# EAGLE design Tractive System Active Light rev5 (EAGLE 9.6.2)

## Sheet 1 of 2
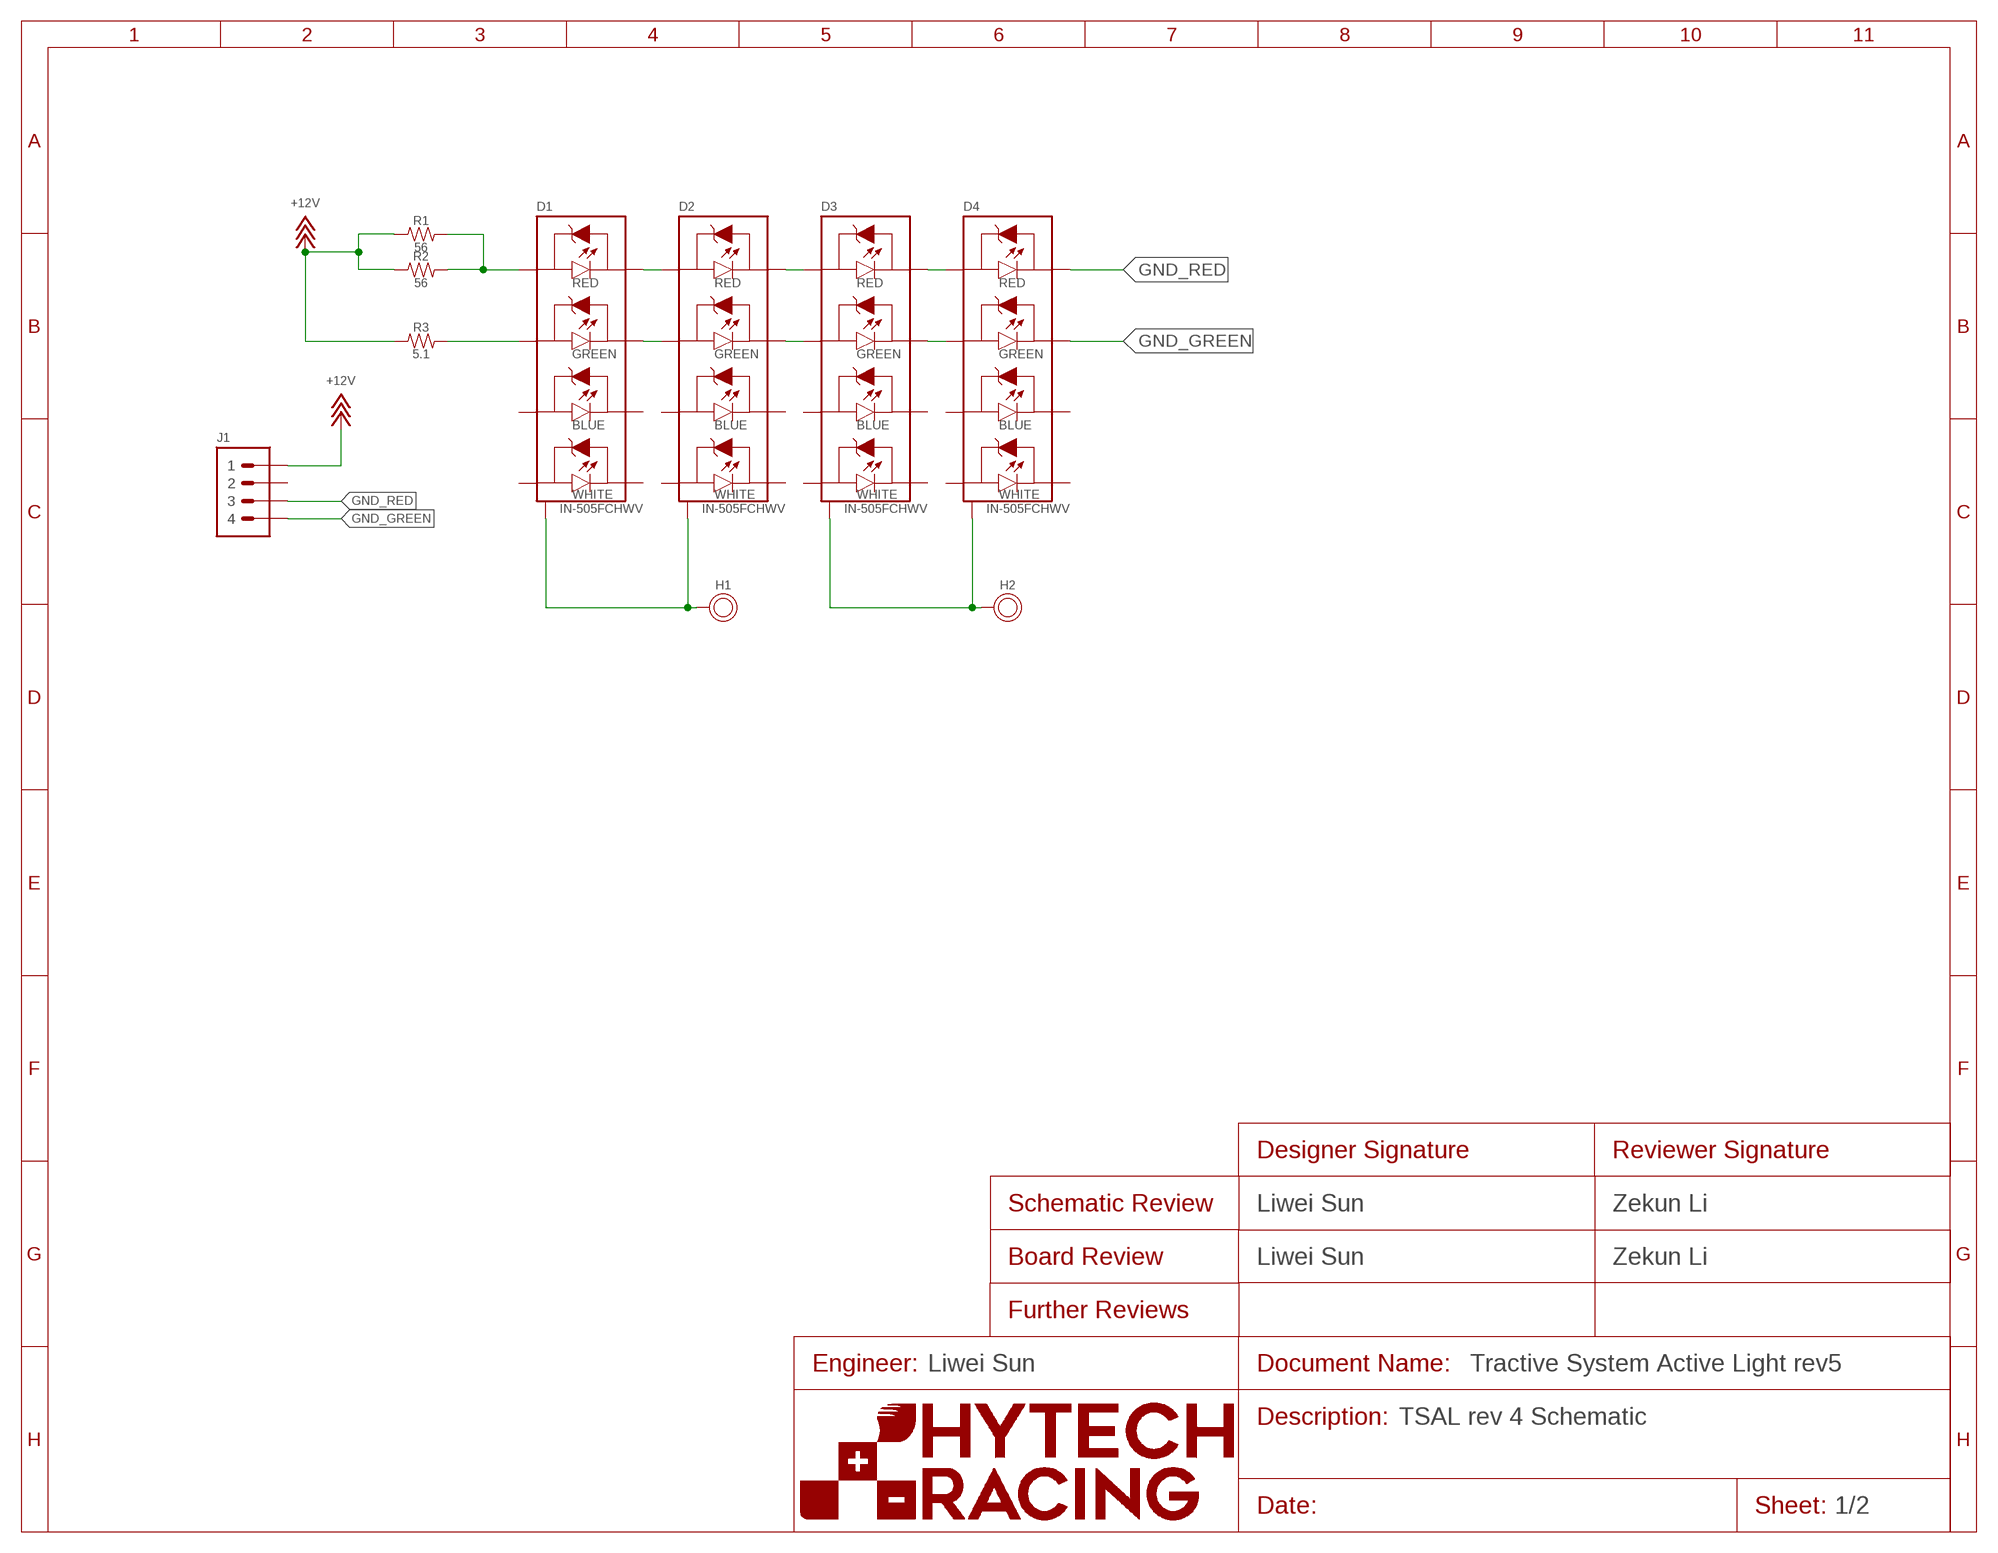
[diagram p0: schematic, sheet 1]
FRAME1 (FRAME): DESCRIPTION_1: TSAL rev 4 Schematic; DESIGNER_BOARD: Liwei Sun; DESIGNER_SCHEMATIC: Liwei Sun; ENGINEER: Liwei Sun; REVIEWER_BOARD: Zekun Li; REVIEWER_SCHEMATIC: Zekun Li

### Parts
D1  LED_RGBW_IN-505FCHWV  [IN-505FCHWV]
D2  LED_RGBW_IN-505FCHWV  [IN-505FCHWV]
D3  LED_RGBW_IN-505FCHWV  [IN-505FCHWV]
D4  LED_RGBW_IN-505FCHWV  [IN-505FCHWV]
H1  MOUNTING_HEATSINK_M3  [MOUNTING_M3]
H2  MOUNTING_HEATSINK_M3  [MOUNTING_M3]
J1  CONNECTOR-4_μF_S_RA_  [MOLEX_MICROFIT_SMD_RIGHTANGLE_04_DUAL]
R1  RESISTOR_0805_56  [0805-RES]
R2  RESISTOR_0805_56  [0805-RES]
R3  RESISTOR_0603_5.1  [0603-RES]

### Nets
+12V: J1.1 R1.1 R2.1 R3.1
GND_GREEN: D4.B-(GREEN-) J1.4
GND_RED: D4.A-(RED-) J1.3
N$1: D3.A-(RED-) D4.A+(RED+)
N$2: D3.B-(GREEN-) D4.B+(GREEN+)
N$3: D2.A-(RED-) D3.A+(RED+)
N$4: D2.B-(GREEN-) D3.B+(GREEN+)
N$5: D1.A-(RED-) D2.A+(RED+)
N$6: D1.B-(GREEN-) D2.B+(GREEN+)
N$7: D1.A+(RED+) R1.2 R2.2
N$8: D1.THERMAL D2.THERMAL H1.P$1
N$9: D1.B+(GREEN+) R3.2
N$13: D3.THERMAL D4.THERMAL H2.P$1
Unconnected: D1.C+(BLUE+) D1.C-(BLUE-) D1.D+(WHITE+) D1.D-(WHITE-) D2.C+(BLUE+) D2.C-(BLUE-) D2.D+(WHITE+) D2.D-(WHITE-) D3.C+(BLUE+) D3.C-(BLUE-) D3.D+(WHITE+) D3.D-(WHITE-) D4.C+(BLUE+) D4.C-(BLUE-) D4.D+(WHITE+) D4.D-(WHITE-) J1.2

## Sheet 2 of 2
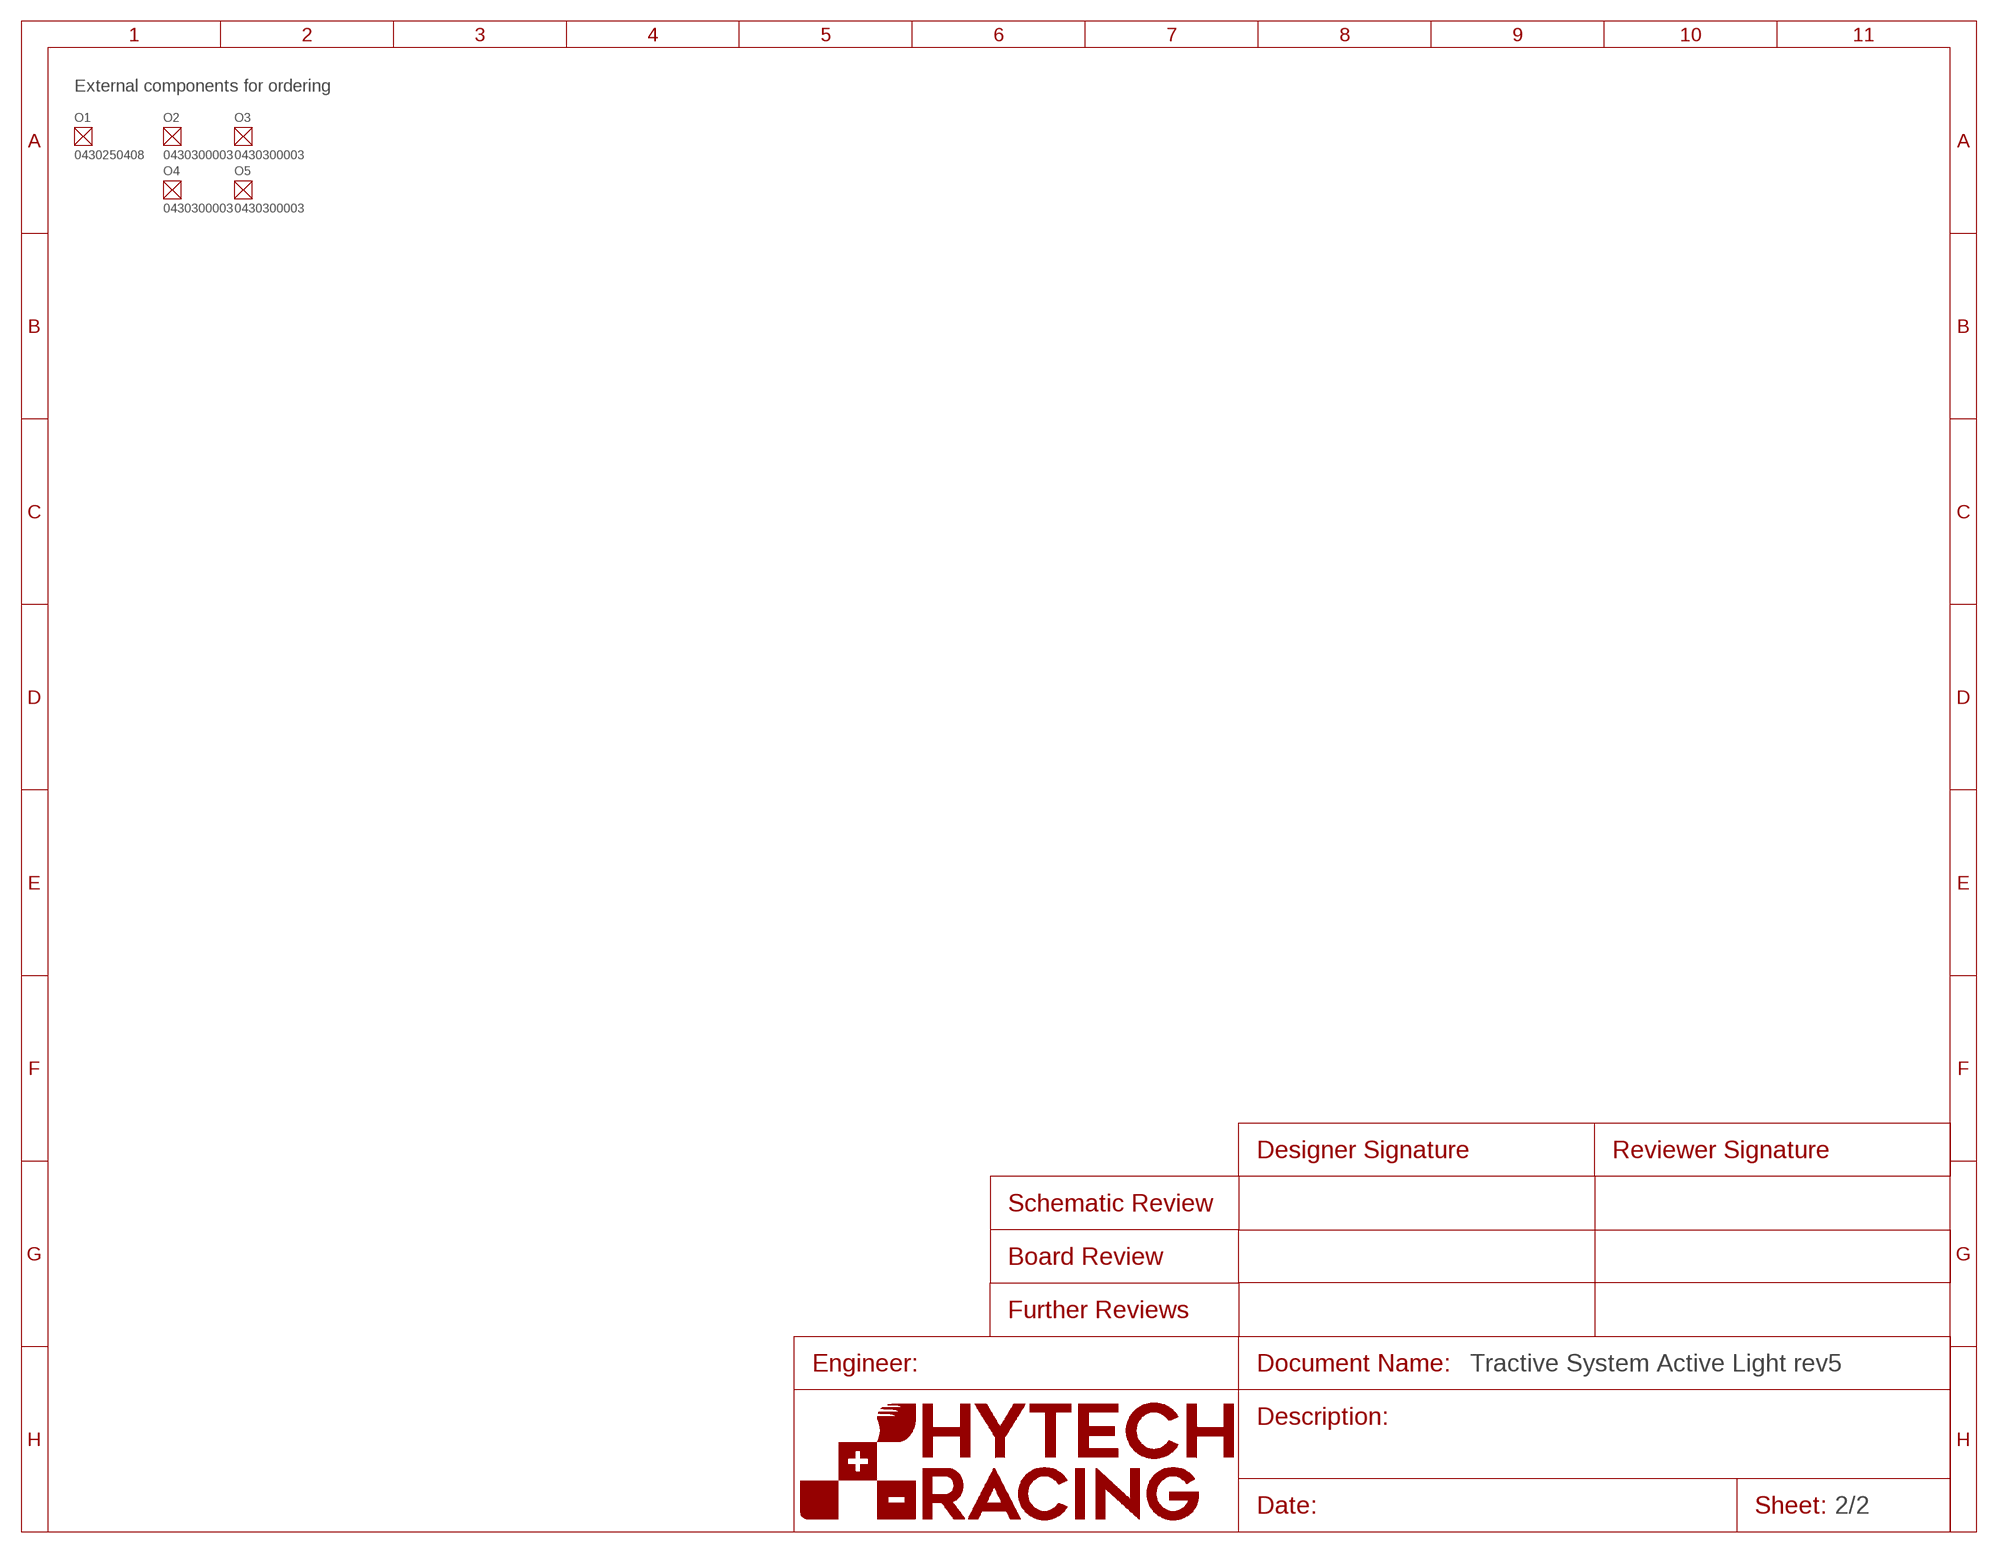
[diagram p1: schematic, sheet 2]
O1 (RECEPTACLE-4_MICROFIT): DKPN: WM11225-ND; MANUFACTURER: Molex; MOPN: 538-43025-0408; MPN: 0430250408
O2 (CRIMP_MICROFIT_20-24): DKPN: WM2776CT-ND; GAUGE: 20-24; MANUFACTURER: Molex; MOPN: 538-43030-0003; MPN: 0430300003
O3 (CRIMP_MICROFIT_20-24): DKPN: WM2776CT-ND; GAUGE: 20-24; MANUFACTURER: Molex; MOPN: 538-43030-0003; MPN: 0430300003
O4 (CRIMP_MICROFIT_20-24): DKPN: WM2776CT-ND; GAUGE: 20-24; MANUFACTURER: Molex; MOPN: 538-43030-0003; MPN: 0430300003
O5 (CRIMP_MICROFIT_20-24): DKPN: WM2776CT-ND; GAUGE: 20-24; MANUFACTURER: Molex; MOPN: 538-43030-0003; MPN: 0430300003

### Notes on the sheet
- External components for ordering

## Library data of the parts
D1-D4 = HyTechDevices:LED_RGBW_*: Inolux IN-505FCHWV RGBW LED Datasheet <https://www.mouser.com/datasheet/2/180/IN-505FCHWV-1488542.pdf>; COLOR: RGBW; DKPN: 1830-1097-2-ND; MANUFACTURER: INOLUX; MOPN: 743-IN-505FCHWV; MPN: IN-505FCHWV
H1 H2 = HyTechDevices:MOUNTING_HEATSINK_*: M3 Mounting Hole Datasheet <https://www.engineersedge.com/iso_socket_head_screw.htm>
J1 = HyTechDevices:CONNECTOR-4_?_*; DKPN: WM1832CT-ND; MANUFACTURER: Molex; MOPN: 538-0430450411; MPN: 0430450411
R1 R2 = HyTechDevices:RESISTOR_?_*: Resistor PWR163 Series <https://www.mouser.com/datasheet/2/54/pwr163-777985.pdf> AC Series <https://www.mouser.com/datasheet/2/447/Yageo_PYu_AC_51_RoHS_L_7_1714230-1874691.pdf> PU Series <https://www.mouser.com/datasheet/2/447/PYu-PU_51_RoHS_L_6-1504619.pdf> ERA Series <https://www.mouser.com/datasheet/2/315/AOA0000C307-1149632.pdf> PWR263 Series <https://www.mouser.com/datasheet/2/54/pwr263s_35-778069.pdf> RC Series <https://www.mouser.com/datasheet/2/447/Yageo_03_18_2021_PYu_RC_Group_51_RoHS_L_11-2199992.pdf> ERJ PB3, PB6 Series <https://www.mouser.com/datasheet/2/315/AOA0000C328-1530132.pdf> ERJ PA2, P03, PA3, P06, P08, P14 Series <https://www.mouser.com/datasheet/2/315/AOA0000C331-1141874.pdf>; DKPN: P16053TR-ND; MANUFACTURER: Panasonic Electronic Components; MOPN: 667-ERJ-P06D56R0V; MPN: ERJ-P06D56R0V; POWER: 0.5W; RESISTANCE: 56; TOLERANCE: 5%; VOLTAGE_CONTINUOUS: 5.29V; VOLTAGE_MAX: 400V
R3 = HyTechDevices:RESISTOR_?_*: Resistor PWR163 Series <https://www.mouser.com/datasheet/2/54/pwr163-777985.pdf> AC Series <https://www.mouser.com/datasheet/2/447/Yageo_PYu_AC_51_RoHS_L_7_1714230-1874691.pdf> PU Series <https://www.mouser.com/datasheet/2/447/PYu-PU_51_RoHS_L_6-1504619.pdf> ERA Series <https://www.mouser.com/datasheet/2/315/AOA0000C307-1149632.pdf> PWR263 Series <https://www.mouser.com/datasheet/2/54/pwr263s_35-778069.pdf> RC Series <https://www.mouser.com/datasheet/2/447/Yageo_03_18_2021_PYu_RC_Group_51_RoHS_L_11-2199992.pdf> ERJ PB3, PB6 Series <https://www.mouser.com/datasheet/2/315/AOA0000C328-1530132.pdf> ERJ PA2, P03, PA3, P06, P08, P14 Series <https://www.mouser.com/datasheet/2/315/AOA0000C331-1141874.pdf>; DKPN: P16039TR-ND; MANUFACTURER: Panasonic Electronic Components; MOPN: 667-ERJ-P03J5R1V; MPN: ERJ-P03J5R1V; POWER: 0.25W; RESISTANCE: 5.1; TOLERANCE: 1%; VOLTAGE_CONTINUOUS: 1.13V; VOLTAGE_MAX: 150V

## Board
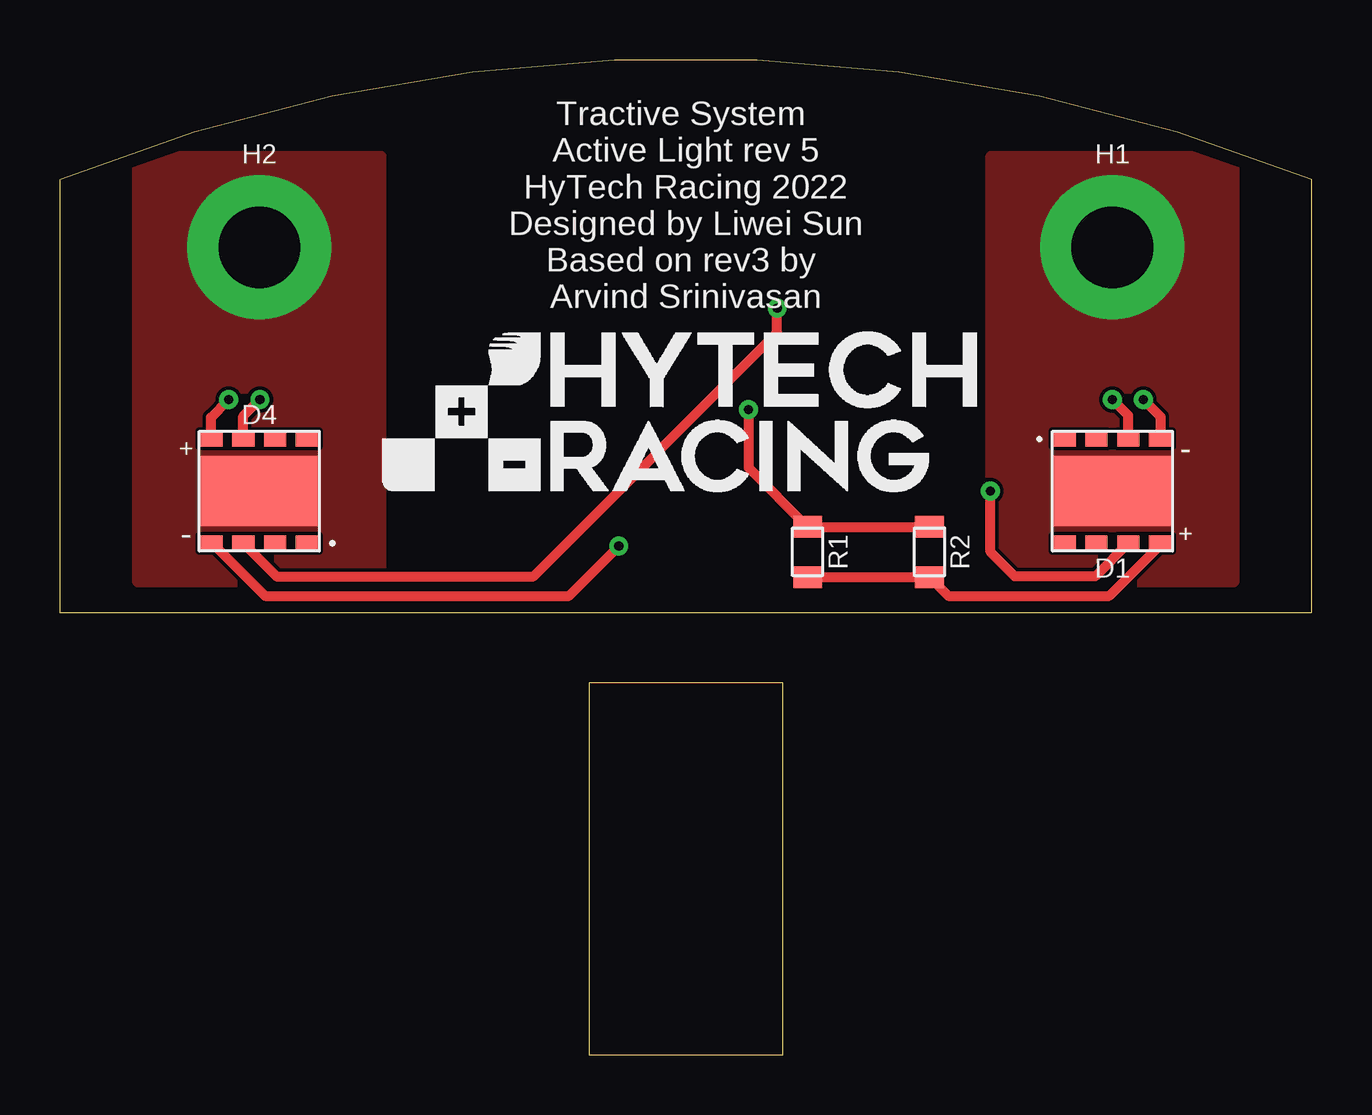
[diagram p2: board, top side]
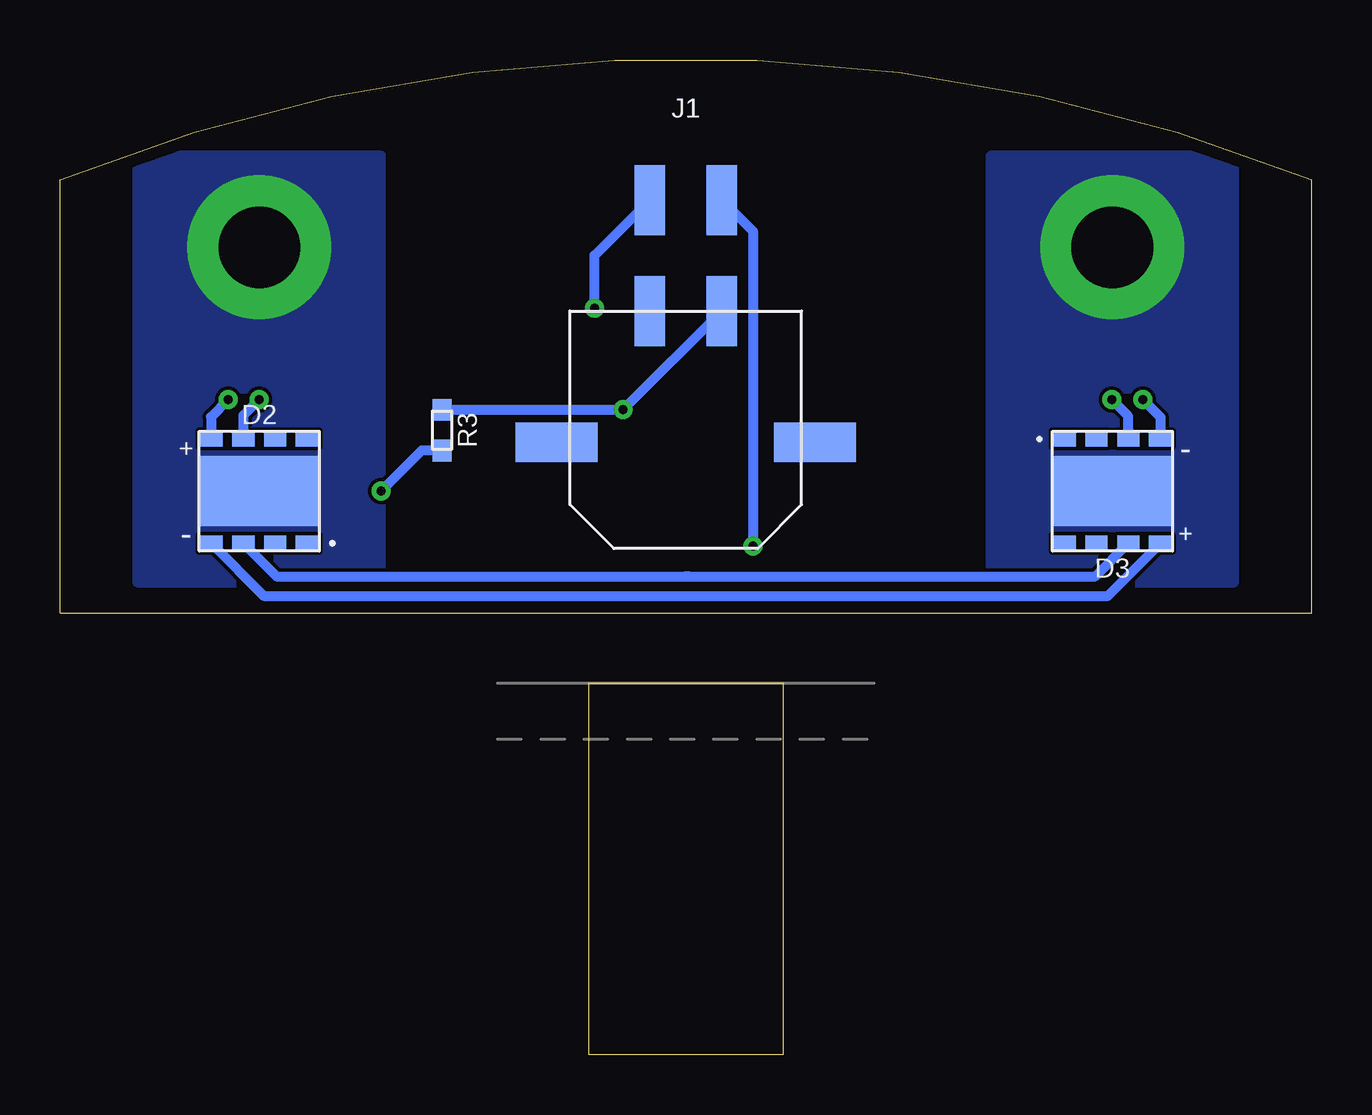
[diagram p3: board, bottom side, seen from below]

Size 52.17 x 23.05 mm. Coordinates in mm from the lower left corner, seen from the top.
Outline: 52.17,0 52.17,18.06 arc44 0,18.06 0,0 52.17,0
Copper layers (1*16): Top 0.035mm / dielectric 1.53mm / Bottom 0.035mm
Design rules "HyTech Default (2 Layer)": minimum track width 6mil, minimum drill 14mil, track to track 6mil, track to pad 6mil, pad to pad 6mil, via to via 20mil, smd to smd 6mil, copper to edge 20mil, drill to drill 21mil, minimum pad ring 7mil, minimum via ring 8mil, stop-mask expansion 6mil, vias tented up to drill 30mil, thermal gap 10mil

### Footprints (pad centres in the part's own frame; a part is rotated, then mirrored left to right if it is on the bottom)
IN-505FCHWV = smd 0.975 x 0.65: A+ -2.013,2.175; A- -2.013,-2.175; D+ 2.013,2.175; D- 2.013,-2.175 | smd 0.925 x 0.65: B+ -0.662,2.175; B- -0.662,-2.175; C+ 0.662,2.175; C- 0.662,-2.175 | smd 5 x 2.9: THERMAL 0,0
MOUNTING_M3 = drill 3.4 pad 6: P$1 0,0
MOLEX_MICROFIT_SMD_RIGHTANGLE_04_DUAL = smd 1.27 x 2.921: 1 1.5,5.474; 2 -1.5,5.474; 3 1.5,10.097; 4 -1.5,10.097 | smd 3.429 x 1.651: PAD1 5.386,0; PAD2 -5.386,0
0805-RES = smd 0.9 x 1.2: 1 -1.05,0; 2 1.05,0
0603-RES = smd 0.9 x 0.8: 1 -0.85,0; 2 0.85,0

### Placement (x,y rotation side)
D1  43.87,5.08 180 top
D2  43.87,5.08 0 bottom
D3  8.31,5.08 180 bottom
D4  8.31,5.08 0 top
H1  43.87,15.24 0 top
H2  8.31,15.24 0 top
J1  26.09,7.11 0 bottom
R1  31.17,2.54 270 top
R2  36.25,2.54 270 top
R3  36.25,7.62 270 bottom
U$2  [LOGO_HYTECH_MEDIUM]  13.39,5.08 0 top

### Tracks (layer width: path | path; a pad name or v marks a point on that pad's centre or on a via)
+12V  (via drill 0.38)
  Top 0.406: R2.1 R1.1 28.7,6.05 v28.7,8.47
  Bottom 0.406: J1.1 v28.7,8.47 R3.1
GND_GREEN  (via drill 0.38)
  Top 0.406: D4.B- 9.02,1.52 19.74,1.52 29.9,11.68 v29.9,12.7
  Bottom 0.406: v29.9,12.7 29.9,14.9 J1.4
GND_RED  (via drill 0.38)
  Top 0.406: D4.A- 6.35,2.9 8.55,0.71 21.21,0.71 v23.29,2.79
  Bottom 0.406: J1.3 23.29,15.91 v23.29,2.79
N$1  (via drill 0.38)
  Top 0.406: D4.A+ 6.29,8.15 v7.04,8.89
  Bottom 0.406: D4.A+ 6.29,8.15 v7.04,8.89
N$2  (via drill 0.38)
  Top 0.406: D4.B+ 7.64,8.2 v8.33,8.89
  Bottom 0.406: D4.B+ 7.64,8.2 v8.33,8.89
N$3
  Bottom 0.406: D2.A- 43.69,0.71 8.49,0.71 D3.A+
N$4
  Bottom 0.406: D2.B- 43.15,1.52 26.09,1.52 25.96,1.52 9.02,1.52 D3.B+
N$5  (via drill 0.38)
  Top 0.406: D2.A+ 45.88,8.17 v45.16,8.89
  Bottom 0.406: v45.16,8.89 45.88,8.17 D2.A+
N$6  (via drill 0.38)
  Top 0.406: D2.B+ 44.53,8.23 v43.87,8.89
  Bottom 0.406: v43.87,8.89 44.53,8.23 D2.B+
N$7
  Top 0.406: R1.2 R2.2 37.02,0.71 43.74,0.71 45.88,2.85 D1.A+
N$8
  pour Top (no thermals): 38.79,19.05 48.95,19.05 48.95,1.27 38.79,1.27
  pour Bottom (no thermals): 38.79,19.05 48.95,19.05 48.95,1.27 38.79,1.27
N$9  (via drill 0.38)
  Top 0.406: D1.B+ 43.15,1.52 39.8,1.52 38.79,2.54 v38.79,5.08
  Bottom 0.406: R3.2 37.1,6.77 v38.79,5.08
N$13
  pour Bottom (no thermals): 3.23,19.05 13.39,19.05 13.39,1.27 3.23,1.27
  pour Top (no thermals): 3.23,19.05 13.39,19.05 13.39,1.27 3.23,1.27

### Text on the board
tPlace: Tractive System / Active Light rev 5 / HyTech Racing 2022 / Designed by Liwei Sun / Based on rev3 by / Arvind Srinivasan